# EAGLE design schematic (EAGLE 7.6.0)
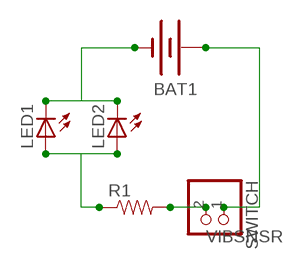
[diagram p0: schematic, sheet 1]

## Parts
BAT1  BATTERY12PTH  [BATTCON_12MM_PTH]
LED1  LED5MM  [LED5MM]
LED2  LED5MM  [LED5MM]
R1  RESISTORKIT  [AXIAL-0.3-KIT]
SWITCH  PINHD-1X2  [1X02]

## Nets
N$2: BAT1.GND(-) LED1.K(C) LED2.K(C)
N$3: LED1.A LED2.A R1.P$1
N$5: R1.P$2 SWITCH.2
VIBSNSR: BAT1.VCC@1(+) SWITCH.1

## Library data of the parts
BAT1 = SparkFun-Electromechanical:BATTERY: Battery Holders Various common sizes : AA, AAA, 18650 (PRT-12895), 20mm coin cell and 12mm coin cell. 20MM_4LEGS, BATT-10373; PROD_ID: BATT-08315
LED1 LED2 = led:LED: LED OSRAM: - CHIPLED LG R971, LG N971, LY N971, LG Q971, LY Q971, LO R971, LY R971 LH N974, LH R974 LS Q976, LO Q976, LY Q976 LO Q996 - Hyper CHIPLED LW Q18S LB Q993, LB Q99A, LB R99A - SideLED LS A670, LO A670, LY A670, LG A670, LP A670 LB A673, LV A673, LT A673, LW A673 LH A674 LY A675 LS A676, LA A676, LO A676, LY A676, LW A676 LS A679, LY A679, LG A679 - Hyper Micro SIDELED® LS Y876, LA Y876, LO Y876, LY Y876 LT Y87S - SmartLED LW L88C, LW L88S LB L89C, LB L89S, LG L890 LS L89K, LO L89K, LY L89K LS L896, LA L896, LO L896, LY L896 - TOPLED LS T670, LO T670, LY T670, LG T670, LP T670 LSG T670, LSP T670, LSY T670, LOP T670, LYG T670 LG T671, LOG T671, LSG T671 LB T673, LV T673, LT T673, LW T673 LH T674 LS T676, LA T676, LO T676, LY T676, LB T676, LH T676, LSB T676, LW T676 LB T67C, LV T67C, LT T67C, LS T67K, LO T67K, LY T67K, LW E67C LS E67B, LA E67B, LO E67B, LY E67B, LB E67C, LV E67C, LT E67C LW T67C LS T679, LY T679, LG T679 LS T770, LO T770, LY T770, LG T770, LP T770 LB T773, LV T773, LT T773, LW T773 LH T774 LS E675, LA E675, LY E675, LS T675 LS T776, LA T776, LO T776, LY T776, LB T776 LHGB T686 LT T68C, LB T68C - Hyper Mini TOPLED® LB M676 - Mini TOPLED Santana® LG M470 LS M47K, LO M47K, LY M47K Source: http://www.osram.convergy.de LUXEON: - LUMILED® LXK2-PW12-R00, LXK2-PW12-S00, LXK2-PW14-U00, LXK2-PW14-V00 LXK2-PM12-R00, LXK2-PM12-S00, LXK2-PM14-U00 LXK2-PE12-Q00, LXK2-PE12-R00, LXK2-PE12-S00, LXK2-PE14-T00, LXK2-PE14-U00 LXK2-PB12-K00, LXK2-PB12-L00, LXK2-PB12-M00, LXK2-PB14-N00, LXK2-PB14-P00, LXK2-PB14-Q00 LXK2-PR12-L00, LXK2-PR12-M00, LXK2-PR14-Q00, LXK2-PR14-R00 LXK2-PD12-Q00, LXK2-PD12-R00, LXK2-PD12-S00 LXK2-PH12-R00, LXK2-PH12-S00 LXK2-PL12-P00, LXK2-PL12-Q00, LXK2-PL12-R00 Source: www.luxeon.com KINGBRIGHT: KA-3528ASYC Source: www.kingbright.com
R1 = SparkFun-Passives:RESISTOR: Resistor Basic schematic elements and footprints for 0603, 1206, and PTH resistors.
SWITCH = pinhead:PINHD-1X2: PIN HEADER

## Board
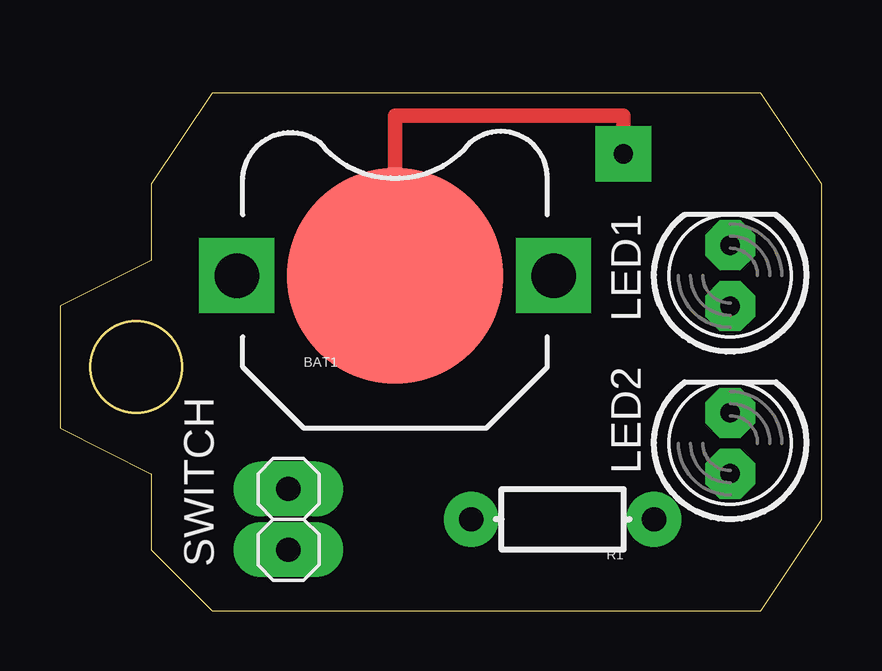
[diagram p1: board, top side]
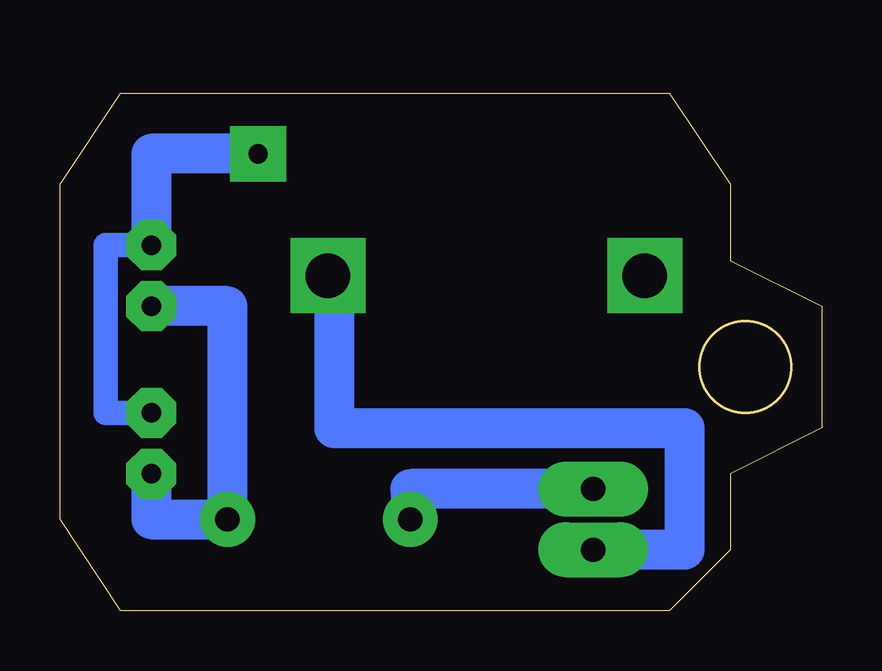
[diagram p2: board, bottom side, seen from below]

Size 31.75 x 21.59 mm. Coordinates in mm from the lower left corner, seen from the top.
Outline: 6.35,0 29.21,0 31.75,3.81 31.75,17.78 29.21,21.59 6.35,21.59 3.81,17.78 3.81,14.61 0,12.7 0,7.62 3.81,5.72 3.81,2.54 6.35,0
Outline: circle at 3.17,10.16 radius 1.91
Copper layers (1*16): Top 0.035mm / dielectric 1.5mm / Bottom 0.035mm
Design rules "default *": minimum track width 10mil, minimum drill 24mil, track to track 8mil, track to pad 8mil, pad to pad 8mil, via to via 8mil, smd to smd 8mil, copper to edge 40mil, drill to drill 8mil, minimum pad ring 25mil, minimum via ring 30mil, stop-mask expansion 4mil, vias tented up to drill 0mil, thermal gap 10mil

### Footprints (pad centres in the part's own frame; a part is rotated, then mirrored left to right if it is on the bottom)
BATTCON_12MM_PTH = smd 9 x 9: GND 0,0 | drill 1.854 square: VCC@1 6.604,0; VCC@2 -6.604,0
LED5MM = drill 0.813 octagon: A -1.27,0; K 1.27,0
AXIAL-0.3-KIT = drill 1.016 pad 2.032: P$1 -3.81,0; P$2 3.81,0
1X02 = drill 1.016 long: 1 -1.27,0; 2 1.27,0

### Placement (x,y rotation side)
BAT1  13.97,13.97 0 top
LED1  27.94,13.97 90 top
LED2  27.94,6.98 90 top
R1  20.95,3.81 180 top
SWITCH  9.53,3.81 90 top

### Tracks (layer width: path | path; a pad name or v marks a point on that pad's centre or on a via)
N$2  (via drill 0.8)
  Top 0.61: BAT1.GND 13.97,20.64 23.49,20.64 v23.49,19.05
  Bottom 1.016: LED2.K 29.84,8.25 29.84,15.24 LED1.K
  Bottom 1.676: v23.49,19.05 27.94,19.05 LED1.K
N$3
  Bottom 1.676: LED2.A 27.94,3.81 R1.P$1 24.77,12.7 LED1.A
N$5
  Bottom 1.676: SWITCH.2 17.14,5.08 R1.P$2
VIBSNSR
  Bottom 1.676: SWITCH.1 5.71,2.54 5.71,7.62 20.32,7.62 20.32,12.7 BAT1.VCC@1